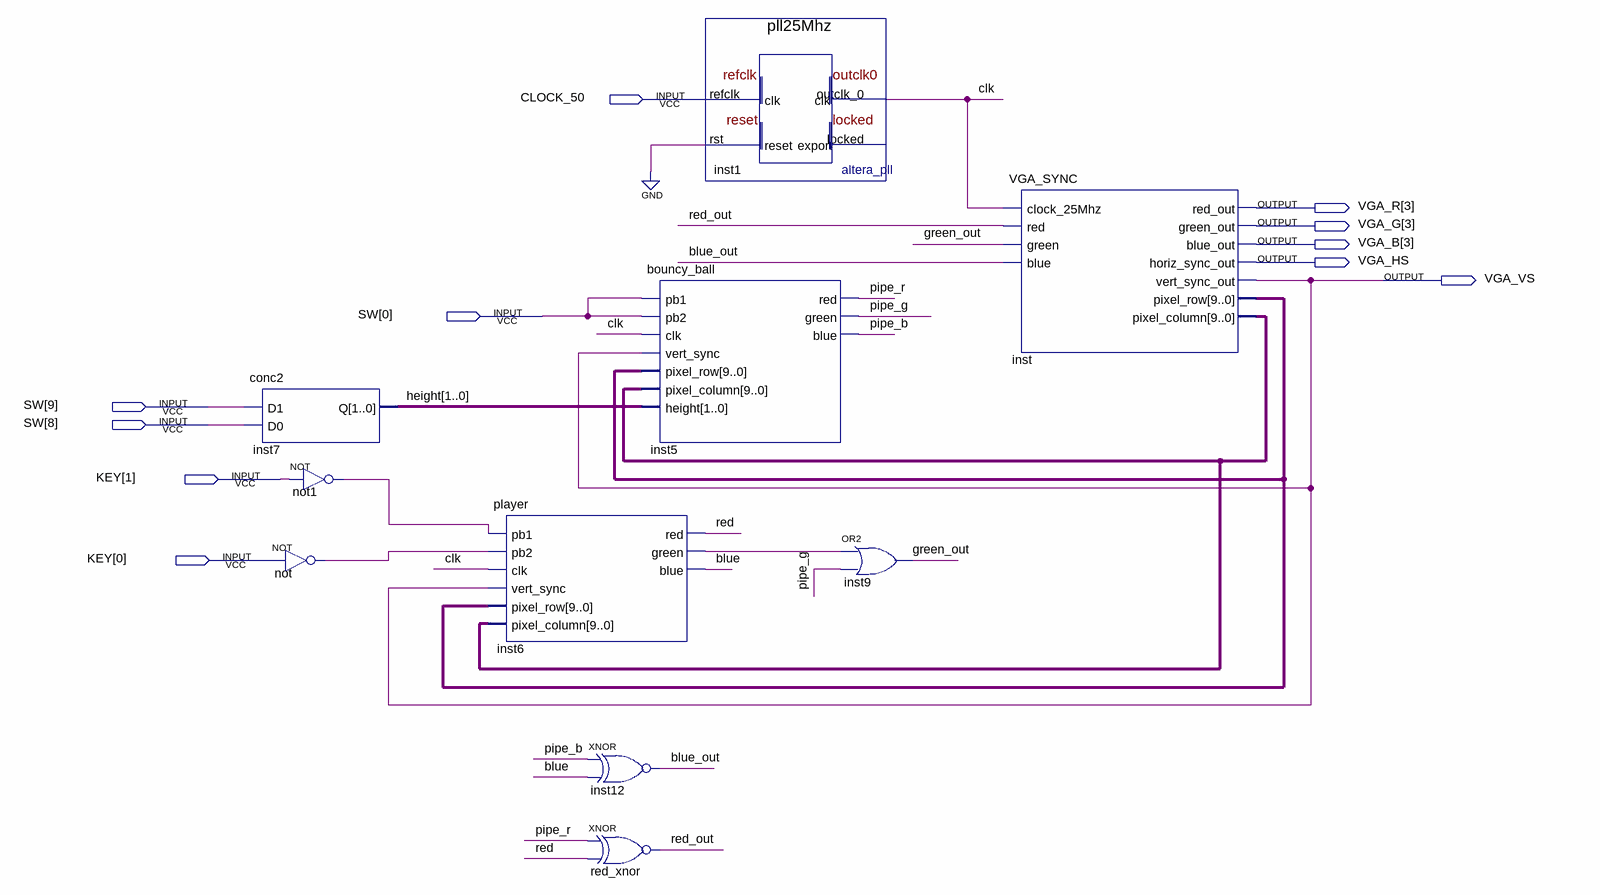
[diagram p0: schematic sheet]
// Quartus schematic pipe_tester.bdf as structural Verilog: 10 symbols, 11 pins
module pipe_tester (
  input  CLOCK_50,
  input  [9:0] SW,
  input  [1:0] KEY,
  output [3:3] VGA_R,
  output [3:3] VGA_G,
  output [3:3] VGA_B,
  output VGA_HS,
  output VGA_VS
);

  wire blue, blue_out, clk, green_out, inst6_green, not1_out, not_out, pipe_b, pipe_g, pipe_r, red, red_out;
  wire [1:0] height;
  wire [9:0] inst_pixel_column, inst_pixel_row;

  conc2 inst7 (.D1(SW[9]), .D0(SW[8]), .Q(height));
  not not1 (not1_out, KEY[1]);
  not \not  (not_out, KEY[0]);
  player inst6 (
    .pb1(not1_out), .pb2(not_out), .clk(clk), .vert_sync(VGA_VS), .pixel_row(inst_pixel_row),
    .pixel_column(inst_pixel_column), .red(red), .green(inst6_green), .blue(blue));
  xnor inst12 (blue_out, pipe_b, blue);
  xnor red_xnor (red_out, pipe_r, red);
  bouncy_ball inst5 (
    .pb1(SW[0]), .pb2(SW[0]), .clk(clk), .vert_sync(VGA_VS), .pixel_row(inst_pixel_row),
    .pixel_column(inst_pixel_column), .height(height), .red(pipe_r), .green(pipe_g), .blue(pipe_b));
  pll25Mhz inst1 (.refclk(CLOCK_50), .rst(1'b0), .outclk_0(clk));  // open: locked
  or inst9 (green_out, inst6_green, pipe_g);
  VGA_SYNC inst (
    .clock_25Mhz(clk), .red(red_out), .green(green_out), .blue(blue_out), .red_out(VGA_R[3]),
    .green_out(VGA_G[3]), .blue_out(VGA_B[3]), .horiz_sync_out(VGA_HS), .vert_sync_out(VGA_VS),
    .pixel_row(inst_pixel_row), .pixel_column(inst_pixel_column));
endmodule
